# Altium schematic sheet LED_STRIP_DRIVER.SchDoc
size B; DocumentNumber: 2; SheetNumber: 2; SheetTotal: 2
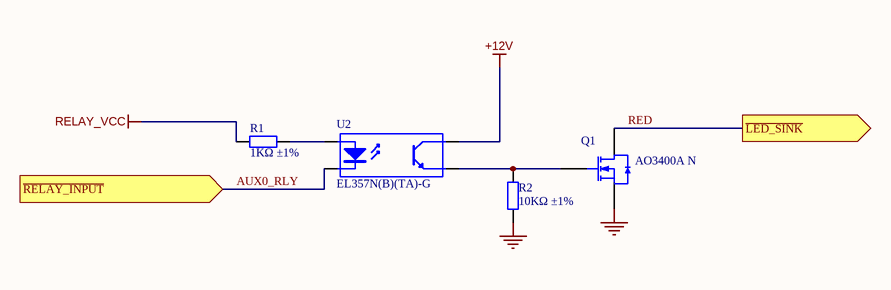
[diagram p0: LED_STRIP_DRIVER.SchDoc]

## Parts
Q1  AO3400A N  [SOT-23-3L]
R1  1KΩ ±1%  [0402_R]
R2  10KΩ ±1%  [0402_R]
U2  EL357N(B)(TA)-G  [SOP-4_P2.54]

## Ports
~{LED_SINK} (out), ~{RELAY_INPUT} (in)

## Nets
+12V: U2.4(C)
GND: Q1.2(S) R2.1
RELAY_VCC: R1.1
AUX0_RLY: U2.2(K) ; port ~{RELAY_INPUT}
RED: Q1.3(D) ; port ~{LED_SINK}
NetQ1_1: Q1.1(G) R2.2 U2.3(E)
NetR1_2: R1.2 U2.1(A)

## Notes on the sheet
- SHEET
- Expatria Technologies
- 1136 Glade Court
- Port Coquitlam, BC V3B 1R5
- PROJECT
- SIZE
- ENGR
- MODIFIED
- DOCUMENT
- REV
- Copyright Expatria Technologies 2021.  This document describes Open Hardware and is licensed under the CERN-OHL-P  v2.  No warranty is implied or expressed.
- EMAIL: INFO@EXPATRIA.CA
- B
- /

## Library data of the parts
Q1 = AO3400A N道沟 X0YV1T SOT-23: MOS(场效应管); ComponentLink1Description: 供应商链接; ComponentLink1URL: http://www.szlcsc.com/product/details_21629.html; Package: SOT-23; Supplier: LC; SuppliersPartNumber: C20917
R1 = 0402 1K (1001) 1%: Chip resistor; Manufacturer: Uniroyal Elec; PartNumber: 0402WGF1001TCE; Power: 1/16W; ComponentLink1Description: Supplier link; ComponentLink1URL: http://www.szlcsc.com/product/details_12256.html; Package: 0402; Supplier: LC; SuppliersPartNumber: C11702; Resistance: 1KΩ; Tolerance: 1%
R2 = 0402 10K (1002) 1%: Chip resistor; Manufacturer: Uniroyal Elec; PartNumber: 0402WGF1002TCE; Power: 1/16W; ComponentLink1Description: Supplier link; ComponentLink1URL: http://www.szlcsc.com/product/details_26487.html; Package: 0402; Supplier: LC; SuppliersPartNumber: C25744; Resistance: 10KΩ; Tolerance: 1%
U2 = EL357N(B)(TA)-G_[C6649]: Optocoupler SOP-4, EL357N(B)(TA)-G, Everlight Electronics; ComponentLink1Description: 供应商链接; ComponentLink1URL: http://www.szlcsc.com/product/details_7114.html; Package: SOP-4_P2.54; Supplier: LC; SuppliersPartNumber: C6649; Manufacturer 1: Everlight; Manufacturer Part Number 1: EL357N(B)(TA)-G